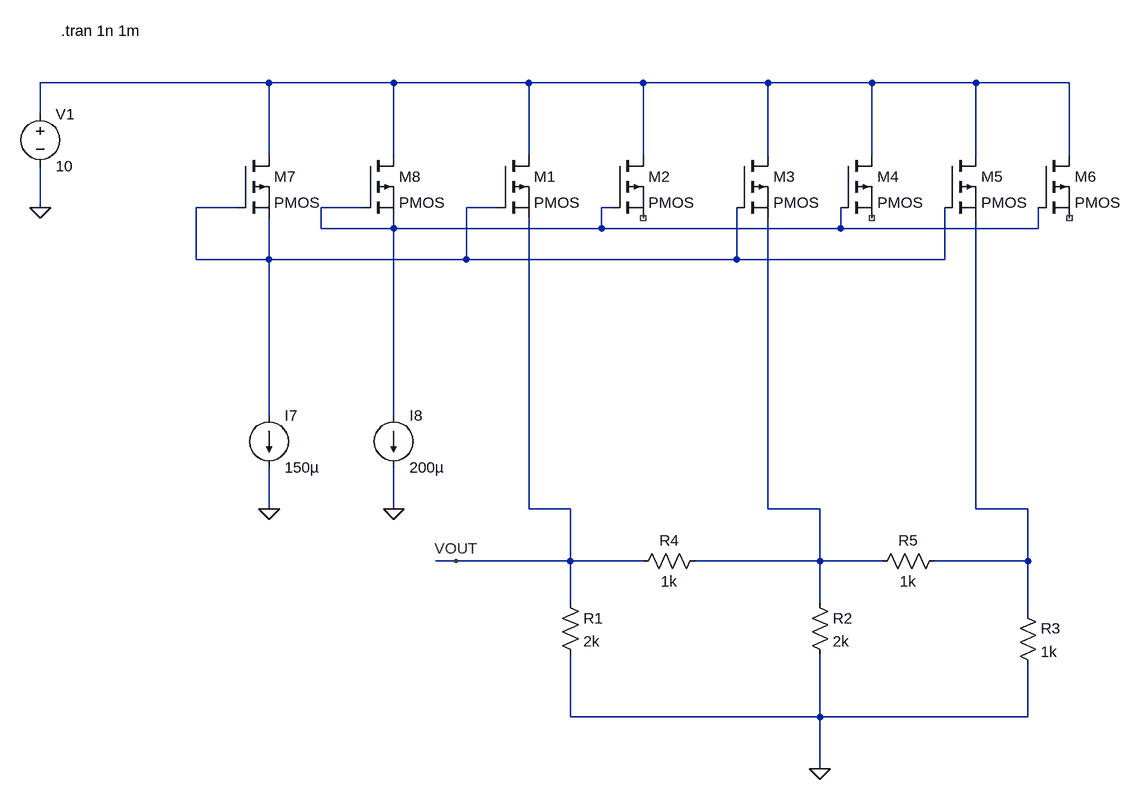
[diagram p0: schematic weighted_r_dac_high_side_mirror.asc]
weighted_r_dac_high_side_mirror.asc, the LTspice schematic file:
Version 4
SHEET 1 1200 704
WIRE -448 -368 -800 -368
WIRE -256 -368 -448 -368
WIRE -48 -368 -256 -368
WIRE 128 -368 -48 -368
WIRE 320 -368 128 -368
WIRE 480 -368 320 -368
WIRE 640 -368 480 -368
WIRE 784 -368 640 -368
WIRE -800 -320 -800 -368
WIRE -448 -256 -448 -368
WIRE -256 -256 -256 -368
WIRE -48 -256 -48 -368
WIRE 128 -256 128 -368
WIRE 320 -256 320 -368
WIRE 480 -256 480 -368
WIRE 640 -256 640 -368
WIRE 784 -256 784 -368
WIRE -800 -176 -800 -240
WIRE -496 -176 -560 -176
WIRE -304 -176 -368 -176
WIRE -96 -176 -144 -176
WIRE 80 -176 64 -176
WIRE -368 -144 -368 -176
WIRE -256 -144 -256 -160
WIRE -256 -144 -368 -144
WIRE 64 -144 64 -176
WIRE 64 -144 -256 -144
WIRE 432 -144 432 -176
WIRE 432 -144 64 -144
WIRE 736 -144 736 -176
WIRE 736 -144 432 -144
WIRE -560 -96 -560 -176
WIRE -448 -96 -448 -160
WIRE -448 -96 -560 -96
WIRE -144 -96 -144 -176
WIRE -144 -96 -448 -96
WIRE 272 -96 272 -176
WIRE 272 -96 -144 -96
WIRE 592 -96 592 -176
WIRE 592 -96 272 -96
WIRE -448 144 -448 -96
WIRE -256 144 -256 -144
WIRE -448 288 -448 224
WIRE -256 288 -256 224
WIRE -48 288 -48 -160
WIRE 16 288 -48 288
WIRE 320 288 320 -160
WIRE 400 288 320 288
WIRE 640 288 640 -160
WIRE 720 288 640 288
WIRE -160 368 -192 368
WIRE 16 368 16 288
WIRE 16 368 -160 368
WIRE 128 368 16 368
WIRE 400 368 400 288
WIRE 400 368 208 368
WIRE 496 368 400 368
WIRE 720 368 720 288
WIRE 720 368 576 368
WIRE 16 432 16 368
WIRE 400 432 400 368
WIRE 720 448 720 368
WIRE 16 608 16 512
WIRE 400 608 400 512
WIRE 400 608 16 608
WIRE 720 608 720 528
WIRE 720 608 400 608
WIRE 400 688 400 608
FLAG 400 688 0
FLAG -160 368 VOUT
FLAG -448 288 0
FLAG -256 288 0
FLAG -800 -176 0
SYMBOL res 0 416 R0
SYMATTR InstName R1
SYMATTR Value 2k
SYMBOL res 384 416 R0
SYMATTR InstName R2
SYMATTR Value 2k
SYMBOL res 704 432 R0
SYMATTR InstName R3
SYMATTR Value 1k
SYMBOL res 224 352 R90
WINDOW 0 0 56 VBottom 2
WINDOW 3 32 56 VTop 2
SYMATTR InstName R4
SYMATTR Value 1k
SYMBOL res 592 352 R90
WINDOW 0 0 56 VBottom 2
WINDOW 3 32 56 VTop 2
SYMATTR InstName R5
SYMATTR Value 1k
SYMBOL pmos -96 -256 R0
SYMATTR InstName M1
SYMBOL pmos 80 -256 R0
SYMATTR InstName M2
SYMBOL pmos 272 -256 R0
SYMATTR InstName M3
SYMBOL pmos 432 -256 R0
SYMATTR InstName M4
SYMBOL pmos 592 -256 R0
SYMATTR InstName M5
SYMBOL pmos 736 -256 R0
SYMATTR InstName M6
SYMBOL voltage -800 -336 R0
SYMATTR InstName V1
SYMATTR Value 10
SYMBOL pmos -496 -256 R0
SYMATTR InstName M7
SYMBOL pmos -304 -256 R0
SYMATTR InstName M8
SYMBOL current -448 144 R0
SYMATTR InstName I7
SYMATTR Value 150µ
SYMBOL current -256 144 R0
SYMATTR InstName I8
SYMATTR Value 200µ
TEXT -768 -448 Left 2 !.tran 1n 1m

The netlist it stands for:
* weighted_r_dac_high_side_mirror.asc
R1 VOUT 0 2k
R2 N004 0 2k
R3 N005 0 1k
R4 N004 VOUT 1k
R5 N005 N004 1k
M1 N001 N002 VOUT VOUT PMOS
M2 N001 N003 NC_01 NC_01 PMOS
M3 N001 N002 N004 N004 PMOS
M4 N001 N003 NC_02 NC_02 PMOS
M5 N001 N002 N005 N005 PMOS
M6 N001 N003 NC_03 NC_03 PMOS
V1 N001 0 10
M7 N001 N002 N002 N002 PMOS
M8 N001 N003 N003 N003 PMOS
I7 N002 0 150µ
I8 N003 0 200µ
.model NMOS NMOS
.model PMOS PMOS
.lib standard.mos
.tran 1n 1m
.backanno
.end